# EAGLE design untitled (EAGLE 7.7.0)
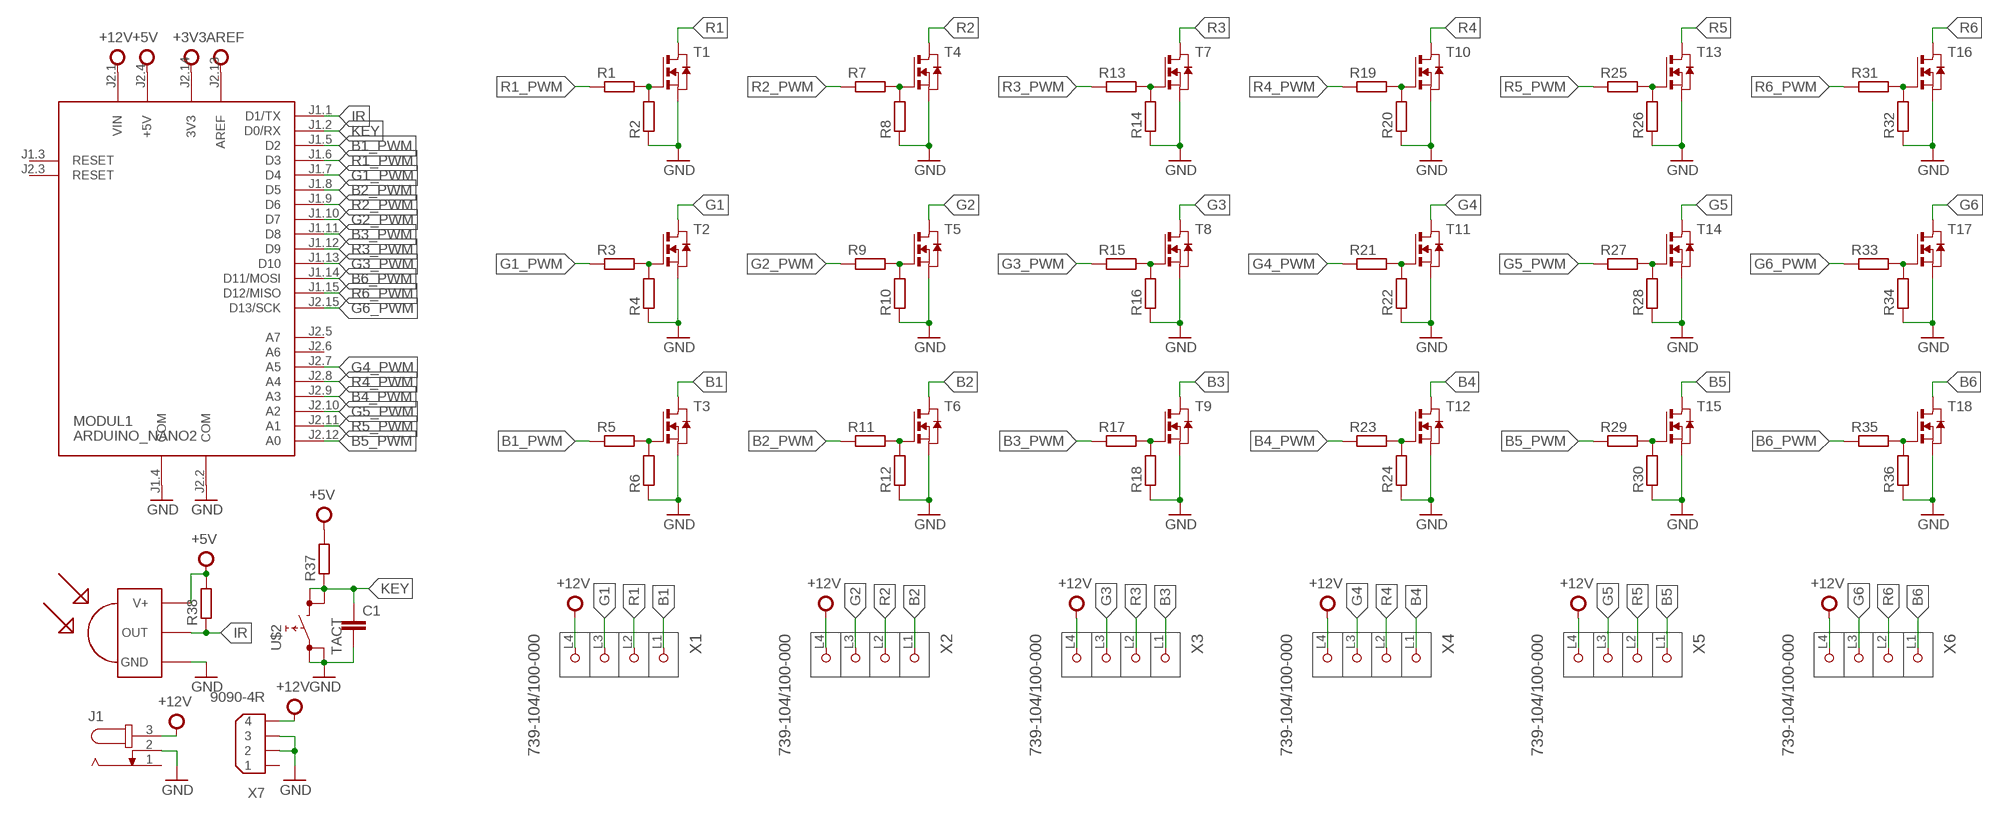
[diagram p0: schematic, sheet 1]

## Parts
C1  C-EUC0805  [C0805]
J1  JACK-PLUG1  [SPC4078]
MODUL1  ARDUINO_NANO2  [ARDUINO_NANO2]
R1  R-EU_R0805  [R0805]
R2  R-EU_R0805  [R0805]
R3  R-EU_R0805  [R0805]
R4  R-EU_R0805  [R0805]
R5  R-EU_R0805  [R0805]
R6  R-EU_R0805  [R0805]
R7  R-EU_R0805  [R0805]
R8  R-EU_R0805  [R0805]
R9  R-EU_R0805  [R0805]
R10  R-EU_R0805  [R0805]
R11  R-EU_R0805  [R0805]
R12  R-EU_R0805  [R0805]
R13  R-EU_R0805  [R0805]
R14  R-EU_R0805  [R0805]
R15  R-EU_R0805  [R0805]
R16  R-EU_R0805  [R0805]
R17  R-EU_R0805  [R0805]
R18  R-EU_R0805  [R0805]
R19  R-EU_R0805  [R0805]
R20  R-EU_R0805  [R0805]
R21  R-EU_R0805  [R0805]
R22  R-EU_R0805  [R0805]
R23  R-EU_R0805  [R0805]
R24  R-EU_R0805  [R0805]
R25  R-EU_R0805  [R0805]
R26  R-EU_R0805  [R0805]
R27  R-EU_R0805  [R0805]
R28  R-EU_R0805  [R0805]
R29  R-EU_R0805  [R0805]
R30  R-EU_R0805  [R0805]
R31  R-EU_R0805  [R0805]
R32  R-EU_R0805  [R0805]
R33  R-EU_R0805  [R0805]
R34  R-EU_R0805  [R0805]
R35  R-EU_R0805  [R0805]
R36  R-EU_R0805  [R0805]
R37  R-EU_R0805  [R0805]
R38  R-EU_R0805  [R0805]
T1  NMOSSOT23  [SOT-23]
T2  NMOSSOT23  [SOT-23]
T3  NMOSSOT23  [SOT-23]
T4  NMOSSOT23  [SOT-23]
T5  NMOSSOT23  [SOT-23]
T6  NMOSSOT23  [SOT-23]
T7  NMOSSOT23  [SOT-23]
T8  NMOSSOT23  [SOT-23]
T9  NMOSSOT23  [SOT-23]
T10  NMOSSOT23  [SOT-23]
T11  NMOSSOT23  [SOT-23]
T12  NMOSSOT23  [SOT-23]
T13  NMOSSOT23  [SOT-23]
T14  NMOSSOT23  [SOT-23]
T15  NMOSSOT23  [SOT-23]
T16  NMOSSOT23  [SOT-23]
T17  NMOSSOT23  [SOT-23]
T18  NMOSSOT23  [SOT-23]
U$1  TSOP1738  [TSOP17XX]
U$2  TACT  [TL1105]
X1  739-104/100-000  [P-739-104/100-000]
X2  739-104/100-000  [P-739-104/100-000]
X3  739-104/100-000  [P-739-104/100-000]
X4  739-104/100-000  [P-739-104/100-000]
X5  739-104/100-000  [P-739-104/100-000]
X6  739-104/100-000  [P-739-104/100-000]
X7  9090-4R  [9090-4R]

## Nets
+3V3: MODUL1.J2.14(3V3)
+5V: MODUL1.J2.4(+5V) R37.2 R38.2 U$1.V+
+12V: J1.3 MODUL1.J2.1(VIN) X1.L4(P4) X2.L4(P4) X3.L4(P4) X4.L4(P4) X5.L4(P4) X6.L4(P4) X7.4
AREF: MODUL1.J2.13(AREF)
B1: T3.1(D) X1.L1(P1)
B1_PWM: MODUL1.J1.5(D2) R5.1
B2: T6.1(D) X2.L1(P1)
B2_PWM: MODUL1.J1.8(D5) R11.1
B3: T9.1(D) X3.L1(P1)
B3_PWM: MODUL1.J1.11(D8) R17.1
B4: T12.1(D) X4.L1(P1)
B4_PWM: MODUL1.J2.9(A3) R23.1
B5: T15.1(D) X5.L1(P1)
B5_PWM: MODUL1.J2.12(A0) R29.1
B6: T18.1(D) X6.L1(P1)
B6_PWM: MODUL1.J1.14(D11/MOSI) R35.1
G1: T2.1(D) X1.L3(P3)
G1_PWM: MODUL1.J1.7(D4) R3.1
G2: T5.1(D) X2.L3(P3)
G2_PWM: MODUL1.J1.10(D7) R9.1
G3: T8.1(D) X3.L3(P3)
G3_PWM: MODUL1.J1.13(D10) R15.1
G4: T11.1(D) X4.L3(P3)
G4_PWM: MODUL1.J2.7(A5) R21.1
G5: T14.1(D) X5.L3(P3)
G5_PWM: MODUL1.J2.10(A2) R27.1
G6: T17.1(D) X6.L3(P3)
G6_PWM: MODUL1.J2.15(D13/SCK) R33.1
GND: C1.2 J1.2 MODUL1.J1.4(COM) MODUL1.J2.2(COM) R2.1 R4.1 R6.1 R8.1 R10.1 R12.1 R14.1 R16.1 R18.1 R20.1 R22.1 R24.1 R26.1 R28.1 R30.1 R32.1 R34.1 R36.1 T1.2(S) T2.2(S) T3.2(S) T4.2(S) T5.2(S) T6.2(S) T7.2(S) T8.2(S) T9.2(S) T10.2(S) T11.2(S) T12.2(S) T13.2(S) T14.2(S) T15.2(S) T16.2(S) T17.2(S) T18.2(S) U$1.GND U$2.1 U$2.3 X7.2 X7.3
IR: MODUL1.J1.1(D1/TX) R38.1 U$1.OUT
KEY: C1.1 MODUL1.J1.2(D0/RX) R37.1 U$2.2 U$2.4
N$1: R1.2 R2.2 T1.3(G)
N$2: R7.2 R8.2 T4.3(G)
N$3: R9.2 R10.2 T5.3(G)
N$4: R3.2 R4.2 T2.3(G)
N$5: R5.2 R6.2 T3.3(G)
N$6: R11.2 R12.2 T6.3(G)
N$7: R13.2 R14.2 T7.3(G)
N$8: R15.2 R16.2 T8.3(G)
N$9: R17.2 R18.2 T9.3(G)
N$10: R19.2 R20.2 T10.3(G)
N$11: R21.2 R22.2 T11.3(G)
N$12: R23.2 R24.2 T12.3(G)
N$13: R25.2 R26.2 T13.3(G)
N$14: R27.2 R28.2 T14.3(G)
N$15: R29.2 R30.2 T15.3(G)
N$16: R31.2 R32.2 T16.3(G)
N$17: R33.2 R34.2 T17.3(G)
N$18: R35.2 R36.2 T18.3(G)
R1: T1.1(D) X1.L2(P2)
R1_PWM: MODUL1.J1.6(D3) R1.1
R2: T4.1(D) X2.L2(P2)
R2_PWM: MODUL1.J1.9(D6) R7.1
R3: T7.1(D) X3.L2(P2)
R3_PWM: MODUL1.J1.12(D9) R13.1
R4: T10.1(D) X4.L2(P2)
R4_PWM: MODUL1.J2.8(A4) R19.1
R5: T13.1(D) X5.L2(P2)
R5_PWM: MODUL1.J2.11(A1) R25.1
R6: T16.1(D) X6.L2(P2)
R6_PWM: MODUL1.J1.15(D12/MISO) R31.1
Unconnected: J1.1 MODUL1.J1.3(RESET) MODUL1.J2.3(RESET) MODUL1.J2.5(A7) MODUL1.J2.6(A6) X7.1

## Library data of the parts
C1 = rcl:C-EU: CAPACITOR, European symbol
J1 = tango:JACK-PLUG: DC POWER JACK Power Jack, DC, Right Angle, Through Hole, Rated 5A at 16VDC, PC Terminals Distributor: Farnell (www.Farnell.de) Drawing: 84N1161.pdf / 84N1162.pdf Manufacturer: SPC Technology (www.spctechnology.com) Type: SPC4077 / SPC 4078
MODUL1 = arduino:ARDUINO_NANO2: Arduino Nano2 Auto generated by modulcreator.ulp \;; ANZAHL: 2; MODUL: TRUE; STECKX0: -76200; STECKX1: 76200; STECKY0: 177800; STECKY1: 177800
R1-R38 = rcl:R-EU_: RESISTOR, European symbol
T1-T18 = zetex:NMOSSOT23: MOS FET; OC_FARNELL: unknown; OC_NEWARK: unknown
U$1 = tsop:TSOP1738: IR Receiver and Demodulator
U$2 = switch1:TACT
X1-X6 = con-wago_739:739-104/100-000: Serie 739, Klemmenleiste für Leiterplatten 1 Einpressstift/Pol / Series 739, PCB terminal strip 1 press-in pin/pole Polzahl / Pole No.: 4 Rastermaß / Pitch: 5 mm Bemessungsspannung / Rated Voltage: 320 V Nennstrom / Nominal Current: 8 A Leiterquerschnitt / Conductor Size: 0.08 - 2.5 mm² Anschlusstechnik / Connection Technology: CAGE CLAMP® Leitereinführung (zur Platine) / Conductor entry angle (to PCB): 90 ° Farbe / Color: grau / gray Stand: 01.01.2012. Die jeweils aktuellen Daten zu diesem Artikel finden Sie in unserem Produktkatalog, den Sie unter www.wago.com einsehen können. As of: 01/01/2012. Please find the newest data for this article in our product catalogue, which can be viewed under www.wago.com.
X7 = con-thomas-betts:9090-4: Disk Drive Power four position Source: Thomas & Betts Electronic Interconnects Eiropean Edition 1998; OC_FARNELL: unknown; OC_NEWARK: unknown

## Board
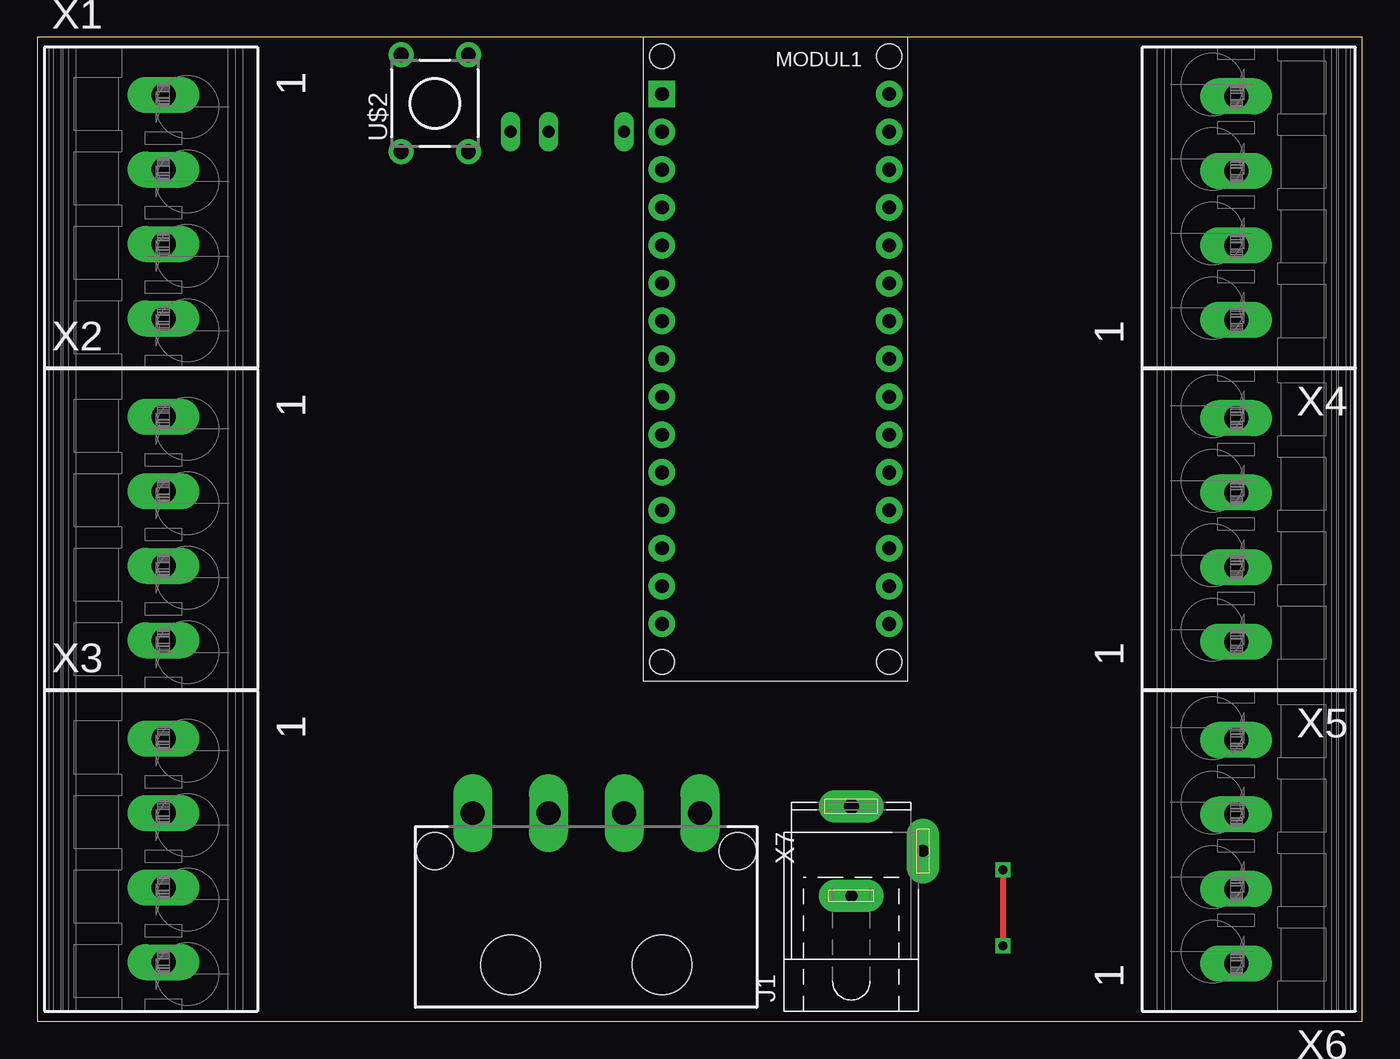
[diagram p1: board, top side]
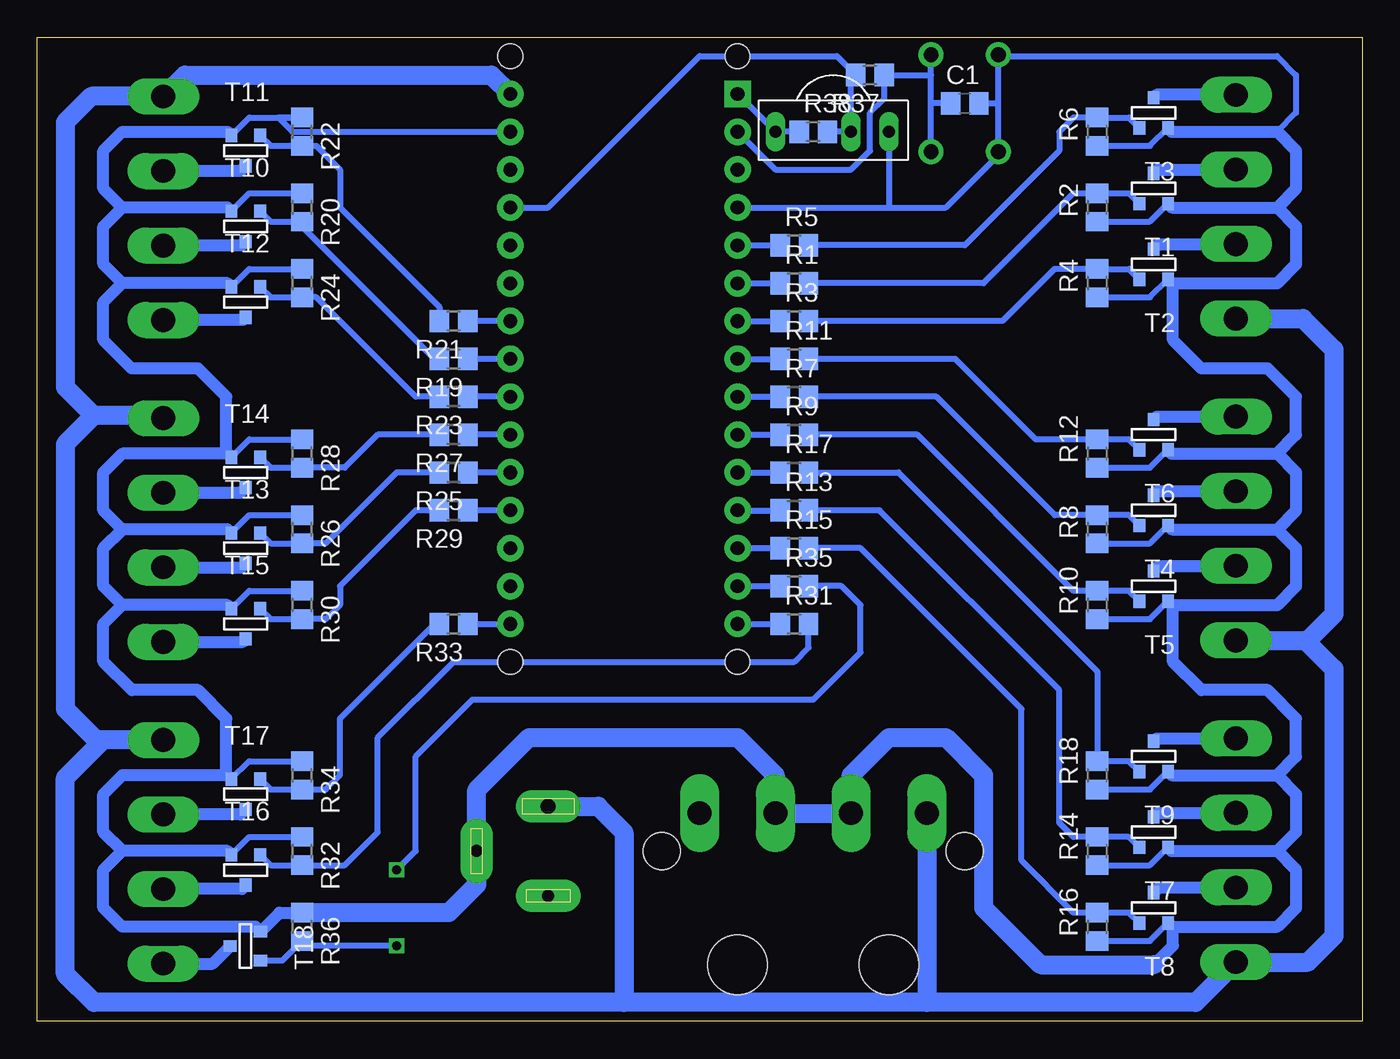
[diagram p2: board, bottom side, seen from below]

Size 88.89 x 66.03 mm. Coordinates in mm from the lower left corner, seen from the top.
Outline: 0,0 88.89,0 88.89,66.03 0,66.03 0,0
Copper layers (1*16): Top 0.035mm / dielectric 1.5mm / Bottom 0.035mm
Design rules "default": minimum track width 10mil, minimum drill 24mil, track to track 8mil, track to pad 8mil, pad to pad 8mil, via to via 8mil, smd to smd 8mil, copper to edge 40mil, drill to drill 8mil, minimum pad ring 10mil, minimum via ring 8mil, stop-mask expansion 4mil, vias tented up to drill 0mil, thermal gap 10mil

### Footprints (pad centres in the part's own frame; a part is rotated, then mirrored left to right if it is on the bottom)
C0805 = smd 1.3 x 1.5: 1 -0.95,0; 2 0.95,0
SPC4078 = drill 0.8 pad 2.184 long: 1 -3,0; 2 0,-4.8 | drill 1 pad 2.184 long: 3 3,0
ARDUINO_NANO2 = drill 0.914 pad 1.778 square: J1.1 -7.62,17.78 | drill 0.914 pad 1.778: J1.2 -7.62,15.24; J1.3 -7.62,12.7; J1.4 -7.62,10.16; J1.5 -7.62,7.62; J1.6 -7.62,5.08; J1.7 -7.62,2.54; J1.8 -7.62,0; J1.9 -7.62,-2.54; J1.10 -7.62,-5.08; J1.11 -7.62,-7.62; J1.12 -7.62,-10.16; J1.13 -7.62,-12.7; J1.14 -7.62,-15.24; J1.15 -7.62,-17.78; J2.1 7.62,17.78; J2.2 7.62,15.24; J2.3 7.62,12.7; J2.4 7.62,10.16; J2.5 7.62,7.62; J2.6 7.62,5.08; J2.7 7.62,2.54; J2.8 7.62,0; J2.9 7.62,-2.54; J2.10 7.62,-5.08; J2.11 7.62,-7.62; J2.12 7.62,-10.16; J2.13 7.62,-12.7; J2.14 7.62,-15.24; J2.15 7.62,-17.78 | hole 1.651: -7.62,-20.32; 7.62,-20.32; 7.62,20.32; -7.62,20.32
R0805 = smd 1.3 x 1.5: 1 -0.95,0; 2 0.95,0
SOT-23 = smd 0.787 x 0.889: 1 0.025,-1.016; 2 -0.94,1.016; 3 0.991,1.016
TSOP17XX = drill 0.813 long: GND -3.81,0; OUT 3.81,0; V+ -1.27,0
TL1105 = drill 1 pad 1.676: 1 -2.25,3.25; 2 2.25,3.25; 3 -2.25,-3.25; 4 2.25,-3.25
P-739-104/100-000 = drill 1.6 long: L1 0.85,7.55; L2 0.85,2.55; L3 0.85,-2.45; L4 0.85,-7.45
9090-4R = drill 1.6 pad 2.6 long: 1 -7.62,-6.35; 2 -2.54,-6.35; 3 2.54,-6.35; 4 7.62,-6.35 | hole 4: -5.08,3.81; 5.08,3.81 | hole 2.5: -10.16,-3.81; 10.16,-3.81

### Placement (x,y rotation side)
C1  26.67,61.59 0 bottom
J1  54.61,11.43 90 top
MODUL1  49.53,44.45 0 top
R1  38.1,49.53 0 bottom
R2  17.78,54.61 90 bottom
R3  38.1,46.99 0 bottom
R4  17.78,49.53 90 bottom
R5  38.1,52.07 0 bottom
R6  17.78,59.69 90 bottom
R7  38.1,41.91 0 bottom
R8  17.78,33.02 90 bottom
R9  38.1,39.37 0 bottom
R10  17.78,27.94 90 bottom
R11  38.1,44.45 0 bottom
R12  17.78,38.1 90 bottom
R13  38.1,34.29 0 bottom
R14  17.78,11.43 90 bottom
R15  38.1,31.75 0 bottom
R16  17.78,6.35 90 bottom
R17  38.1,36.83 0 bottom
R18  17.78,16.51 90 bottom
R19  60.96,44.45 180 bottom
R20  71.12,54.61 270 bottom
R21  60.96,46.99 180 bottom
R22  71.12,59.69 270 bottom
R23  60.96,41.91 180 bottom
R24  71.12,49.53 270 bottom
R25  60.96,36.83 180 bottom
R26  71.12,33.02 270 bottom
R27  60.96,39.37 180 bottom
R28  71.12,38.1 270 bottom
R29  60.96,34.29 180 bottom
R30  71.12,27.94 270 bottom
R31  38.1,26.67 0 bottom
R32  71.12,11.43 270 bottom
R33  60.96,26.67 180 bottom
R34  71.12,16.51 270 bottom
R35  38.1,29.21 0 bottom
R36  71.12,6.35 270 bottom
R37  33.02,63.5 180 bottom
R38  36.83,59.69 0 bottom
T1  13.97,55.88 180 bottom
T2  13.97,50.8 180 bottom
T3  13.97,60.96 180 bottom
T4  13.97,34.29 180 bottom
T5  13.97,29.21 180 bottom
T6  13.97,39.37 180 bottom
T7  13.97,12.7 180 bottom
T8  13.97,7.62 180 bottom
T9  13.97,17.78 180 bottom
T10  74.93,53.34 0 bottom
T11  74.93,58.42 0 bottom
T12  74.93,48.26 0 bottom
T13  74.93,31.75 0 bottom
T14  74.93,36.83 0 bottom
T15  74.93,26.67 0 bottom
T16  74.93,10.16 0 bottom
T17  74.93,15.24 0 bottom
T18  74.93,5.08 270 bottom
U$1  35.56,59.69 180 bottom
U$2  26.67,61.59 0 top
X1  7.62,54.61 0 top
X2  7.62,33.02 0 top
X3  7.62,11.43 0 top
X4  81.28,54.61 180 top
X5  81.28,33.02 180 top
X6  81.28,11.43 180 top
X7  36.83,7.62 180 top

### Tracks (layer width: path | path; a pad name or v marks a point on that pad's centre or on a via)
+5V
  Bottom 0.406: R38.2 U$1.V+ 34.29,63.18 R37.2 35.24,64.77 44.45,64.77 54.61,54.61 MODUL1.J2.4
+12V
  Bottom 0.813: X1.L4 8.43,47.16
  Bottom 1.27: X2.L4 3.81,25.57 | 3.81,25.57 3.64,25.57 1.91,27.3 1.91,45.09 3.98,47.16 X1.L4 | 3.81,25.57 1.91,23.66 1.91,5.71 3.64,3.98 X3.L4 11.18,1.27 29.21,1.27 | MODUL1.J2.1 58.42,63.5 78.99,63.5 X4.L4 85.26,62.06 87,60.33 87,42.55 85.09,40.64 | X5.L4 80.6,40.64 85.09,40.64 | 85.09,40.64 87,38.73 87,20.95 84.92,18.88 84.45,18.88 | X6.L4 84.45,18.88 | 29.21,1.27 49.53,1.27 | 49.53,1.27 85.09,1.27 87,3.17 87,16.34 84.45,18.88 | X7.4 29.21,1.27 | J1.3 51.26,14.43 49.53,12.7 49.53,1.27
B1
  Bottom 0.813: X1.L1 13.81,62.16 T3.1
B1_PWM
  Bottom 0.406: MODUL1.J1.5 R5.1
B2
  Bottom 0.813: T6.1 13.81,40.57 X2.L1
B2_PWM
  Bottom 0.406: MODUL1.J1.8 R11.1
B3
  Bottom 0.813: T9.1 13.81,18.98 X3.L1
B3_PWM
  Bottom 0.406: MODUL1.J1.11 R17.1
B4
  Bottom 0.813: T12.1 75.09,47.06 X4.L1
B4_PWM
  Bottom 0.406: MODUL1.J2.9 R23.1
B5
  Bottom 0.813: X5.L1 75.09,25.47 T15.1
B5_PWM
  Bottom 0.406: MODUL1.J2.12 R29.1
B6
  Bottom 0.813: X6.L1 77.12,3.88 T18.1
B6_PWM
  Bottom 0.406: MODUL1.J1.14 R35.1
G1
  Bottom 0.813: T2.1 13.65,52.16 X1.L3
G1_PWM
  Bottom 0.406: MODUL1.J1.7 R3.1
G2
  Bottom 0.813: T5.1 13.65,30.57 X2.L3
G2_PWM
  Bottom 0.406: MODUL1.J1.10 R9.1
G3
  Bottom 0.813: T8.1 13.65,8.98 X3.L3
G3_PWM
  Bottom 0.406: MODUL1.J1.13 R15.1
G4
  Bottom 0.813: T11.1 75.25,57.06 X4.L3
G4_PWM
  Bottom 0.406: MODUL1.J2.7 R21.1
G5
  Bottom 0.813: X5.L3 75.25,35.47 T14.1
G5_PWM
  Bottom 0.406: MODUL1.J2.10 R27.1
G6
  Bottom 0.813: T17.1 75.25,13.88 X6.L3
G6_PWM
  Bottom 0.406: R33.1 MODUL1.J2.15
GND
  Bottom 0.406: R6.1 14.23,58.74 T3.2 | R2.1 14.23,53.66 T1.2 | R4.1 14.23,48.58 T2.2 | R12.1 14.23,37.15 T6.2 | R8.1 14.23,32.07 T4.2 | R10.1 14.23,26.99 T5.2 | R18.1 14.23,15.56 T9.2 | R14.1 14.23,10.48 T7.2 | R16.1 14.23,5.4 T8.2 | T11.2 74.67,60.64 R22.1 72.7,60.64 71.75,59.69 MODUL1.J2.2 | T10.2 74.67,55.56 R20.1 | T12.2 74.67,50.48 R24.1 | T14.2 74.67,39.05 R28.1 | T13.2 74.67,33.97 R26.1 | T15.2 74.67,28.89 R30.1 | T17.2 74.67,17.46 R34.1 | T16.2 74.67,12.38 R32.1 | MODUL1.J1.4 31.75,54.61 | 31.75,54.61 27.94,54.61 24.42,58.13 U$2.3 24.42,61.59 | 5.71,59.69 4.45,60.96 4.45,63.5 5.71,64.77 24.34,64.77 U$2.1 24.42,61.59 | C1.2 24.42,61.59 | U$1.GND 31.75,54.61
  Bottom 0.813: 5.71,54.61 4.45,55.88 4.45,58.42 5.71,59.69 12.78,59.69 T3.2 | 5.71,54.61 4.45,53.34 4.45,50.8 5.71,49.53 12.7,49.53 | T1.2 12.78,54.61 5.71,54.61 | T2.2 12.78,49.53 12.7,49.53 | 5.71,38.1 4.45,36.83 4.45,34.29 5.71,33.02 | T4.2 12.78,33.02 5.71,33.02 | 5.71,33.02 4.45,31.75 4.45,29.21 5.71,27.94 12.7,27.94 | T5.2 12.78,27.94 12.7,27.94 | 5.71,16.51 4.45,15.24 4.45,12.7 5.71,11.43 | T7.2 12.78,11.43 5.71,11.43 | 5.71,11.43 4.45,10.16 4.45,7.62 5.71,6.35 12.7,6.35 | T6.2 12.78,38.1 5.71,38.1 | 5.71,38.1 4.45,39.37 4.45,41.91 6.35,43.81 10.79,43.81 12.7,45.72 12.7,49.53 | T9.2 12.78,16.51 5.71,16.51 | 5.71,16.51 4.45,17.78 4.45,20.32 6.35,22.23 10.79,22.23 12.7,24.13 12.7,27.94 | 83.19,11.43 84.45,10.16 84.45,7.62 83.19,6.35 74.24,6.35 T18.2 72.63,7.3 R36.1 | T16.2 76.12,11.43 83.19,11.43 | 83.19,11.43 84.45,12.7 84.45,15.24 83.19,16.51 76.12,16.51 T17.2 76.2,16.59 76.2,20.32 78.11,22.23 82.55,22.23 84.45,24.13 84.45,26.67 83.19,27.94 | T15.2 76.12,27.94 83.19,27.94 | 83.19,27.94 84.45,29.21 84.45,31.75 83.19,33.02 | 83.19,33.02 84.45,34.29 84.45,36.83 83.19,38.1 76.12,38.1 T14.2 76.2,38.18 76.2,41.91 78.11,43.81 82.55,43.81 84.45,45.72 84.45,48.26 83.19,49.53 | T13.2 76.12,33.02 83.19,33.02 | T12.2 76.12,49.53 83.19,49.53 | 83.19,49.53 84.45,50.8 84.45,53.34 83.19,54.61 | 83.19,54.61 84.45,55.88 84.45,58.42 83.19,59.69 76.12,59.69 T11.2 | T10.2 76.12,54.61 83.19,54.61 | 13.97,3.81 12.7,5.08 12.7,6.35 | 12.7,6.35 12.78,6.35 T8.2
  Bottom 1.27: 13.97,3.81 21.59,3.81 25.4,7.62 25.4,16.51 27.94,19.05 31.75,19.05 34.29,16.51 X7.3 X7.2 39.37,16.51 41.91,19.05 55.88,19.05 59.41,15.52 J1.2 59.41,9.17 61.28,7.3 R36.1
IR
  Bottom 0.406: R38.1 U$1.OUT MODUL1.J1.1
KEY
  Bottom 0.406: U$2.4 28.92,61.59 | 28.92,61.59 28.92,63.5 | 28.92,63.5 U$2.2 | C1.1 28.92,61.59 | 28.92,63.5 R37.1 32.07,61.91 33.02,60.96 33.02,58.42 34.29,57.15 39.37,57.15 MODUL1.J1.2
N$1
  Bottom 0.406: T1.3 15.66,55.56 R2.2 19.37,55.56 25.4,49.53 R1.2
N$2
  Bottom 0.406: T4.3 15.66,33.97 R8.2 20.64,33.97 28.57,41.91 R7.2
N$3
  Bottom 0.406: T5.3 15.66,28.89 R10.2 19.36,28.89 29.84,39.37 R9.2
N$4
  Bottom 0.406: T2.3 15.66,50.48 R4.2 20.64,50.48 24.13,46.99 R3.2
N$5
  Bottom 0.406: T3.3 15.66,60.64 R6.2 19.37,60.64 20.32,59.69 20.32,58.42 26.67,52.07 R5.2
N$6
  Bottom 0.406: T6.3 15.66,39.05 R12.2 21.91,39.05 27.3,44.45 R11.2
N$7
  Bottom 0.406: T7.3 15.66,12.38 R14.2 19.36,12.38 20.32,13.33 20.32,22.23 32.38,34.29 R13.2
N$8
  Bottom 0.406: T8.3 15.66,7.3 R16.2 19.36,7.3 22.86,10.79 22.86,20.95 33.66,31.75 R15.2
N$9
  Bottom 0.406: T9.3 15.66,17.46 R18.2 17.78,23.5 31.11,36.83 R17.2
N$10
  Bottom 0.406: T10.3 73.24,53.66 71.44,53.66 | R19.2 62.23,44.45 71.44,53.66 | 71.44,53.66 R20.2
N$11
  Bottom 0.406: T11.3 73.24,58.74 R22.2 70.17,58.74 68.58,57.15 68.58,54.61 61.91,47.94 R21.2
N$12
  Bottom 0.406: T12.3 73.24,48.58 R24.2 70.17,48.58 63.5,41.91 R23.2
N$13
  Bottom 0.406: T13.3 73.24,32.07 R26.2 69.53,32.07 64.77,36.83 R25.2
N$14
  Bottom 0.406: T14.3 73.24,37.15 R28.2 68.26,37.15 66.04,39.37 R27.2
N$15
  Bottom 0.406: T15.3 73.24,26.99 R30.2 69.53,26.99 68.58,27.94 68.58,29.21 63.5,34.29 R29.2
N$16
  Bottom 0.406: T16.3 73.24,10.48 R32.2 68.26,10.48 66.04,12.7 66.04,19.05 60.96,24.13 38.1,24.13 37.15,25.08 R31.2
N$17
  Bottom 0.406: T17.3 73.24,15.56 R34.2 69.53,15.56 68.58,16.51 68.58,20.32 62.23,26.67 R33.2
N$18  (via drill 0.6)
  Top 0.406: v64.77,10.16 v64.77,5.08
  Bottom 0.406: R35.2 34.92,29.21 33.66,27.94 33.66,24.77 36.83,21.59 59.69,21.59 63.5,17.78 63.5,11.43 v64.77,10.16 | T18.3 72.43,4.09 R36.2 70.8,5.08 v64.77,5.08
R1
  Bottom 0.813: T1.1 13.73,57.16 X1.L2
R1_PWM
  Bottom 0.406: MODUL1.J1.6 R1.1
R2
  Bottom 0.813: T4.1 13.73,35.57 X2.L2
R2_PWM
  Bottom 0.406: MODUL1.J1.9 R7.1
R3
  Bottom 0.813: T7.1 13.73,13.98 X3.L2
R3_PWM
  Bottom 0.406: MODUL1.J1.12 R13.1
R4
  Bottom 0.813: T10.1 75.17,52.06 X4.L2
R4_PWM
  Bottom 0.406: MODUL1.J2.8 R19.1
R5
  Bottom 0.813: X5.L2 75.17,30.47 T13.1
R5_PWM
  Bottom 0.406: MODUL1.J2.11 R25.1
R6
  Bottom 0.813: T16.1 75.17,8.88 X6.L2
R6_PWM
  Bottom 0.406: MODUL1.J1.15 R31.1